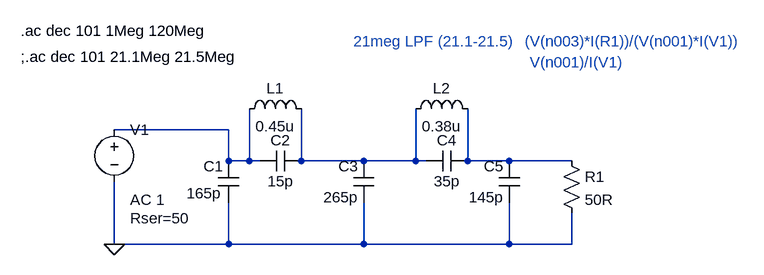
[diagram p0: schematic 21meg_lpf1.asc]
21meg_lpf1.asc, the LTspice schematic file:
Version 4
SHEET 1 1096 680
WIRE 240 160 64 160
WIRE 240 208 240 160
WIRE 272 208 272 128
WIRE 272 208 240 208
WIRE 288 208 272 208
WIRE 352 208 352 128
WIRE 448 208 352 208
WIRE 528 208 528 128
WIRE 528 208 448 208
WIRE 544 208 528 208
WIRE 608 208 608 128
WIRE 672 208 608 208
WIRE 768 208 672 208
WIRE 64 336 64 240
WIRE 240 336 240 272
WIRE 240 336 64 336
WIRE 448 336 448 272
WIRE 448 336 240 336
WIRE 672 336 672 272
WIRE 672 336 448 336
WIRE 768 336 768 288
WIRE 768 336 672 336
FLAG 64 336 0
SYMBOL voltage 64 144 R0
WINDOW 123 24 124 Left 2
WINDOW 39 24 152 Left 2
SYMATTR Value2 AC 1
SYMATTR SpiceLine Rser=50
SYMATTR InstName V1
SYMATTR Value ""
SYMBOL ind 256 144 R270
WINDOW 0 32 56 VTop 2
WINDOW 3 5 56 VBottom 2
SYMATTR InstName L1
SYMATTR Value 0.45u
SYMBOL ind 512 144 R270
WINDOW 0 32 56 VTop 2
WINDOW 3 5 56 VBottom 2
SYMATTR InstName L2
SYMATTR Value 0.38u
SYMBOL res 752 192 R0
SYMATTR InstName R1
SYMATTR Value 50R
SYMBOL cap 256 272 R180
WINDOW 0 24 56 Left 2
WINDOW 3 27 14 Left 2
SYMATTR InstName C1
SYMATTR Value 165p
SYMBOL cap 352 192 R90
WINDOW 0 0 32 VBottom 2
WINDOW 3 32 32 VTop 2
SYMATTR InstName C2
SYMATTR Value 15p
SYMBOL cap 464 272 R180
WINDOW 0 24 56 Left 2
WINDOW 3 24 8 Left 2
SYMATTR InstName C3
SYMATTR Value 265p
SYMBOL cap 544 224 R270
WINDOW 0 32 32 VTop 2
WINDOW 3 0 32 VBottom 2
SYMATTR InstName C4
SYMATTR Value 35p
SYMBOL cap 688 272 R180
WINDOW 0 24 56 Left 2
WINDOW 3 24 8 Left 2
SYMATTR InstName C5
SYMATTR Value 145p
TEXT -80 8 Left 2 !.ac dec 101 1Meg 120Meg
TEXT 432 24 Left 2 ;21meg LPF (21.1-21.5)
TEXT 696 24 Left 2 ;(V(n003)*I(R1))/(V(n001)*I(V1))
TEXT 704 56 Left 2 ;V(n001)/I(V1)
TEXT -80 48 Left 2 !;.ac dec 101 21.1Meg 21.5Meg

The netlist it stands for:
* 21meg_lpf1.asc
V1 N001 0 AC 1 Rser=50
L1 N001 N002 0.45u
L2 N002 N003 0.38u
R1 N003 0 50R
C1 0 N001 165p
C2 N002 N001 15p
C3 0 N002 265p
C4 N002 N003 35p
C5 0 N003 145p
.ac dec 101 1Meg 120Meg
* 21meg LPF (21.1-21.5)
* (V(n003)*I(R1))/(V(n001)*I(V1))
* V(n001)/I(V1)
;.ac dec 101 21.1Meg 21.5Meg
.backanno
.end